# Altium schematic sheet Supply_5V_ISOL.SchDoc: HV_Module
size 420 x 297 mm; EDA_Number: ARTIQ; Projet: HV_Module; Author: G.Kasprowicz; CompanyName: WUT ISE; DrawnBy: G.Kasprowicz; Organization: WUT ISE; Address1: PW ISE; Address2: Nowowiejska 15/19 00-665 Warsaw; Address3: gkasprow@gmail.com; DocumentNumber: 8; Revision: 1.0; SheetNumber: 8; SheetTotal: 11; ModifiedBy: -; CheckedDate: -; Title2: Supply_5V_ISOL; DivGrp: WUT ISE; Designer: G.Kasprowicz; ModifiedDate: -; ProjectName: Sensor Box
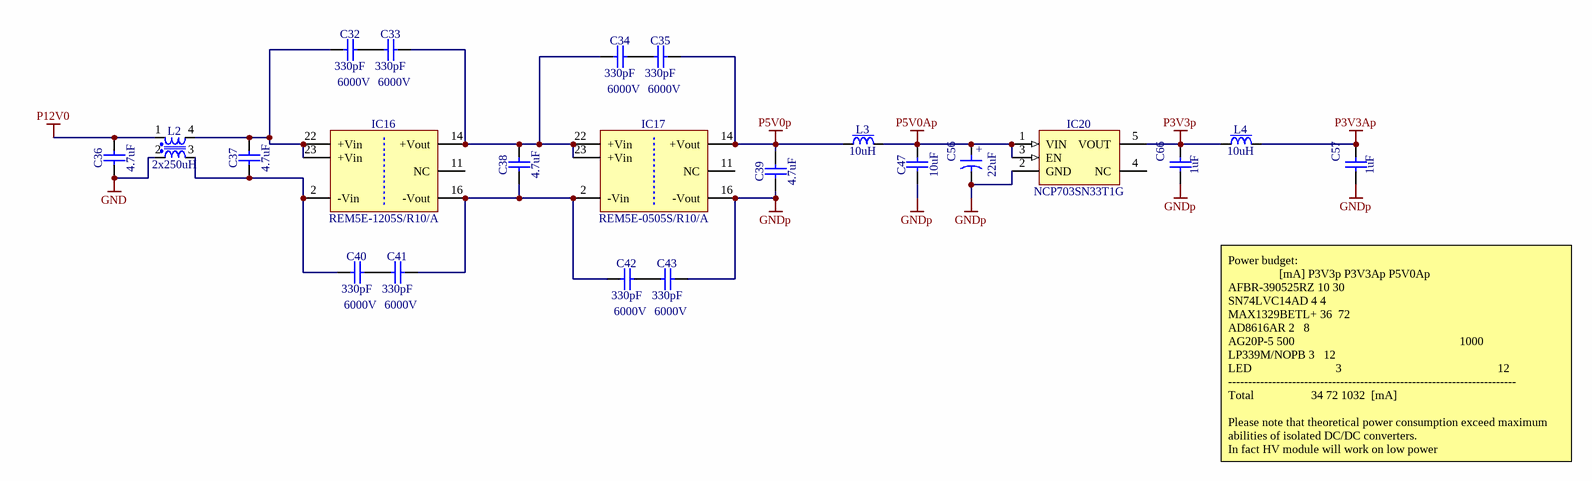
[diagram p0: Supply_5V_ISOL.SchDoc]

## Parts
C32  330pF  Voltage: 6000V  [CAPC4620X220N]
C33  330pF  Voltage: 6000V  [CAPC4620X220N]
C34  330pF  Voltage: 6000V  [CAPC4620X220N]
C35  330pF  Voltage: 6000V  [CAPC4620X220N]
C36  4.7uF  [CAPC2012X145N]
C37  4.7uF  [CAPC2012X145N]
C38  4.7uF  [CAPC2012X145N]
C39  4.7uF  [CAPC2012X145N]
C40  330pF  Voltage: 6000V  [CAPC4620X220N]
C41  330pF  Voltage: 6000V  [CAPC4620X220N]
C42  330pF  Voltage: 6000V  [CAPC4620X220N]
C43  330pF  Voltage: 6000V  [CAPC4620X220N]
C47  10uF  [CAPC1608X80N]
C56  22uF  [CAPMP3528X210N]
C57  1uF  [CAPC1005X55N]
C66  1uF  [CAPC1005X55N]
IC16  REM5E-1205S/R10/A  [DCDC_RECOM_REM5E-XXXXS]
IC17  REM5E-0505S/R10/A  [DCDC_RECOM_REM5E-XXXXS]
IC20  NCP703SN33T1G  [SOT95P275X110-5N]
L2  2x250uH  [IND_WURTH_WE-SL2]
L3  10uH  [IND_BOURNS_PM43]
L4  10uH  [IND_BOURNS_PM43]

## Nets
GND: C36.1 L2.2
GNDp: C39.1 C43.2 C47.1 C56.2 C57.1 C66.1 IC17.16(-Vout) IC20.2(GND)
P3V3Ap: C57.2 L4.2
P3V3p: C66.2 IC20.5(VOUT) L4.1
P5V0Ap: C47.2 C56.1 IC20.1(VIN) IC20.3(EN) L3.2
P5V0p: C35.2 C39.2 IC17.14(+Vout) L3.1
P12V0: C36.2 L2.1
NetC32_1: C32.1 C37.2 IC16.22(+Vin) IC16.23(+Vin) L2.4
NetC32_2: C32.2 C33.1
NetC33_2: C33.2 C34.1 C38.2 IC16.14(+Vout) IC17.22(+Vin) IC17.23(+Vin)
NetC34_2: C34.2 C35.1
NetC37_1: C37.1 C40.1 IC16.2(-Vin) L2.3
NetC38_1: C38.1 C41.2 C42.1 IC16.16(-Vout) IC17.2(-Vin)
NetC40_2: C40.2 C41.1
NetC42_2: C42.2 C43.1

Not connected (* = marked no-connect by the designer): IC16 11(NC); IC17 11(NC); IC20 4(NC)

## Notes on the sheet
- Power budget:
  [mA]	P3V3p	P3V3Ap	P5V0Ap
  AFBR-390525RZ	10	30
  SN74LVC14AD	4	4
  MAX1329BETL+	36		72
  AD8616AR	2			8
  AG20P-5	500	                		                                    1000
  LP339M/NOPB	3			12
  LED                            3                                                    12
  ------------------------------------------------------------------------
  Total		                 34	72	1032  [mA]
  Please note that theoretical power consumption exceed maximum abilities of isolated DC/DC converters.
  In fact HV module will work on low power
- Project/Equipment
- Document
- Designer
- Drawn by
- Check.by
- Copyright WUT ISE 2018.
  This documentation describes Open Hardware and is licensed under the CERN OHL v.1.1. You may redistribute and modify this documentation under the terms of the CERN OHL v.1.1. (http://ohwr.org/CERNOHL). This documentation is distributed WITHOUT ANY EXPRESS OR IMPLIED WARRANTY, INCLUDING OF MERCHANTABILITY, SATISFACTORY QUALITY AND FITNESS FOR A PARTICULAR PURPOSE. Please see the CERN OHL v.1.1 for applicable conditions.
- Contact
- File
- Last Mod.
- Print Date
- Sheet
- Size
- A3
- of
- Rev
- (in symbol CTE3528-21_22UF_20V_10%) +

## Library data of the parts
C32-C35 C40-C43 = CC1808_330pF_6000V_10%_X7R_VISHAY_HV: Non-polarised capacitor; Part Description: SMD Multilayer Ceramic Chip Capacitor Solutions for High Voltage Applications; Manufacturer: VISHAY; Manufacturer Part Number: HV1808Y331KX6ATHV; TC: X7R; Tolerance: ±10%; Part Number: CC1808_330pF_6000V_10%_X7R_VISHAY_HV; Component Kind: Standard; Component Type: Standard; Pin Count: 2; Value: 330pF; Status: None; Case: 1808; Mounted: Yes; Socket: No; SMD: Yes; Sense: No; ComponentHeight: 2.7mm; HelpURL: \\cern.ch\dfs\Applications\Altium\Datasheets\CC1812_VISHAY_HV.pdf; Author: CERN DEM HF; CreateDate: 11.02.2022; LatestRevisionDate: 11.02.2022
C36-C39 = CC0805_4.7UF_50V_10%_X7R: Non-polarised capacitor; Part Description: SMD Multilayer Chip Ceramic Capacitor; Manufacturer: GENERIC; Manufacturer1 Part Number: C2012X7R1H475K125; Voltage: 50V; TC: X7R; Tolerance: ±10%; Part Number: CC0805_4.7UF_50V_10%_X7R; Component Kind: Standard; Component Type: Standard; Pin Count: 2; Value: 4.7uF; Status: Preferred; Manufacturer Part Number: CC0805_4.7UF_50V_10%_X7R; Case: 0805; Mounted: Yes; Socket: No; SMD: Yes; Sense: No; Manufacturer1 Example: TDK; Manufacturer1 ComponentHeight: 1.45mm; HelpURL: \\cern.ch\dfs\Applications\Altium\Datasheets\CC0805_X7R_TDK_C.pdf; Author: CERN DEM JMW; CreateDate: 30.07.2021; LatestRevisionDate: 30.07.2021
C47 = CC0603_10UF_16V_20%_X5R: Non-polarised capacitor; Part Description: SMD Multilayer Chip Ceramic Capacitor; Manufacturer: GENERIC; Manufacturer1 Part Number: GRM188R61C106MA73D; Voltage: 16V; TC: X5R; Tolerance: ±20%; Part Number: CC0603_10UF_16V_20%_X5R; Component Kind: Standard; Component Type: Standard; Pin Count: 2; Value: 10uF; Status: None; Manufacturer Part Number: CC0603_10UF_16V_20%_X5R; Case: 0603; Mounted: Yes; Socket: No; SMD: Yes; Sense: No; Manufacturer1 Example: MURATA; Manufacturer1 ComponentHeight: 0.8mm; HelpURL: \\cern.ch\dfs\Applications\Altium\Datasheets\CC0603_X5R_MURATA_GRM.pdf; Author: CERN DEM MR; CreateDate: 02.03.2016; LatestRevisionDate: 02.03.2016
C56 = CTE3528-21_22UF_20V_10%: Polarised capacitor; Part Description: Solid Tantalum Chip Capacitor; Manufacturer: GENERIC; Manufacturer1 Part Number: TAJB226K020R; Voltage: 20V; Tolerance: ±10%; Part Number: CTE3528-21_22UF_20V_10%; Component Kind: Standard; Component Type: Standard; Pin Count: 2; Value: 22uF; Status: Preferred; Manufacturer Part Number: CTE3528-21_22UF_20V_10%; Case: B; Mounted: Yes; Socket: No; SMD: Yes; Sense: No; Manufacturer1 Example: AVX; Manufacturer1 ComponentHeight: 2.1mm; HelpURL: \\cern.ch\dfs\Applications\Altium\Datasheets\CTE_AVX_TAJ.pdf; Author: CERN DEM JLC; CreateDate: 03/12/2007; LatestRevisionDate: 03/12/2007
C57 C66 = CC0402_1UF_16V_10%_X5R: Non-polarised capacitor; Part Description: SMD Multilayer Chip Ceramic Capacitor; Manufacturer: GENERIC; Manufacturer1 Part Number: C1005X5R1C105KT; Voltage: 16V; TC: X5R; Tolerance: ±10%; Part Number: CC0402_1UF_16V_10%_X5R; Component Kind: Standard; Component Type: Standard; Pin Count: 2; Value: 1uF; Status: Preferred; Manufacturer Part Number: CC0402_1UF_16V_10%_X5R; Case: 0402; Mounted: Yes; Socket: No; SMD: Yes; Sense: No; Manufacturer1 Example: TDK; Manufacturer1 ComponentHeight: 0.55mm; HelpURL: \\cern.ch\dfs\Applications\Altium\Datasheets\CC0402_X5R_TDK_C.pdf; Author: CERN DEM JLC; CreateDate: 2012-10-25; LatestRevisionDate: 2012-10-25
IC16 = REM5E-1205S/R10/A: RECOM, RP Series, Single Output DCDC Converter; Part Description: 12VDC to +5V (+1A), 5W Regulated DC-DC Converter; PressFit: No; Bonding: No; Part Number: REM5E-1205S/R10/A; Component Kind: Standard; Component Type: Standard; Device: REM5E-1205S/R10/A; PackageDescription: REM5E-XXXXS Series, Body 31.8x20.3mm, DIP-24 Package; Manufacturer: RECOM; Manufacturer Part Number: REM5E-1205S/R10/A; Pin Count: 6; Mounted: Yes; Socket: No; SMD: No; Sense: No; ComponentHeight: 10.2mm; HelpURL: \\cern.ch\dfs\Applications\Altium\Datasheets\RECOM_REM5E-XXXXS.pdf; Author: CERN DEM HF; CreateDate: 08.02.2022; LatestRevisionDate: 08.02.2022
IC17 = REM5E-0505S/R10/A: RECOM, RP Series, Single Output DCDC Converter; Part Description: 5VDC to +5V (+1A), 5W Regulated DC-DC Converter; PressFit: No; Bonding: No; Part Number: REM5E-0505S/R10/A; Component Kind: Standard; Component Type: Standard; Device: REM5E-0505S/R10/A; PackageDescription: REM5E-XXXXS Series, Body 31.8x20.3mm, DIP-24 Package; Manufacturer: RECOM; Manufacturer Part Number: REM5E-0505S/R10/A; Pin Count: 6; Mounted: Yes; Socket: No; SMD: No; Sense: No; ComponentHeight: 10.2mm; HelpURL: \\cern.ch\dfs\Applications\Altium\Datasheets\RECOM_REM5E-XXXXS.pdf; Author: CERN DEM HF; CreateDate: 08.02.2022; LatestRevisionDate: 08.02.2022
IC20 = NCP703SN33T1G: 3.3V 300mA, Ultra-Low Quiescent Current, IQ 12uA, Ultra-Low Noise, LDO Voltage Regulator; Manufacturer: ON SEMICONDUCTOR; PressFit: No; Bonding: No; Part Number: NCP703SN33T1G; Component Kind: Standard; Component Type: Standard; Device: NCP703SN33T1G; PackageDescription: SOT, 0.95mm Pitch; 5 Pin, 1.50mm W X 3.00mm L X 1.10mm H Body, IPC Medium Density; Part Description: 3.3V 300mA, Ultra-Low Quiescent Current, IQ 12uA, Ultra-Low Noise, LDO Voltage Regulator; Manufacturer Part Number: NCP703SN33T1G; Pin Count: 5; Case: SOT23-5; Mounted: Yes; Socket: No; SMD: Yes; Sense: No; ComponentHeight: 1.1mm; HelpURL: \\cern.ch\dfs\Applications\Altium\Datasheets\NCP703SN33T1G.pdf; Author: CERN DEM JLC; CreateDate: 16.02.2017; LatestRevisionDate: 16.02.2017
L2 = IND_250UH_50%_WURTH_WE-SL2-744224: Inductor Common Mode; Part Description: Common Mode SMD Line Filter (WE-SL2 Series); Manufacturer: WURTH ELEKTRONIK; Manufacturer Part Number: 744224; Power: 1.2A; Resistance: 0.13R; Tolerance: ±50%; Part Number: IND_250UH_50%_WURTH_WE-SL2-744224; Component Kind: Standard; Component Type: Standard; Pin Count: 4; Value: 2x250uH; Mounted: Yes; Socket: No; SMD: Yes; Sense: No; ComponentHeight: 5.3mm; HelpURL: \\cern.ch\dfs\Applications\Altium\Datasheets\IND_WURTH_WE-SL2_744224.pdf; Author: CERN DEM JLC; CreateDate: 02.12.2009; LatestRevisionDate: 15.10.2012
L3 L4 = IND_10UH_20%_BOURNS_PM43: Inductor With Core; Part Description: SMD Power Inductor; Manufacturer: BOURNS; Manufacturer Part Number: PM43-100M-RC; Power: 1.15A; Resistance: 0.18R; Tolerance: ±20%; Part Number: IND_10UH_20%_BOURNS_PM43; Component Kind: Standard; Component Type: Standard; Pin Count: 2; Value: 10uH; Status: None; Mounted: Yes; Socket: No; SMD: Yes; Sense: No; ComponentHeight: 3.5mm; HelpURL: \\cern.ch\dfs\Applications\Altium\Datasheets\IND_BOURNS_PM43.pdf; Author: CERN DEM JLC; CreateDate: 17/05/2011; LatestRevisionDate: 17/05/2011